# Altium schematic sheet VibrationACQ.SchDoc: VibrationACQ
size A4; Author: Joao Guimaraes; Organization: Altium Limited; Address1: L3, 12a Rodborough Rd; Address2: Frenchs Forest; Address3: NSW; Address4: Australia 2086; Revision: 1.0.0
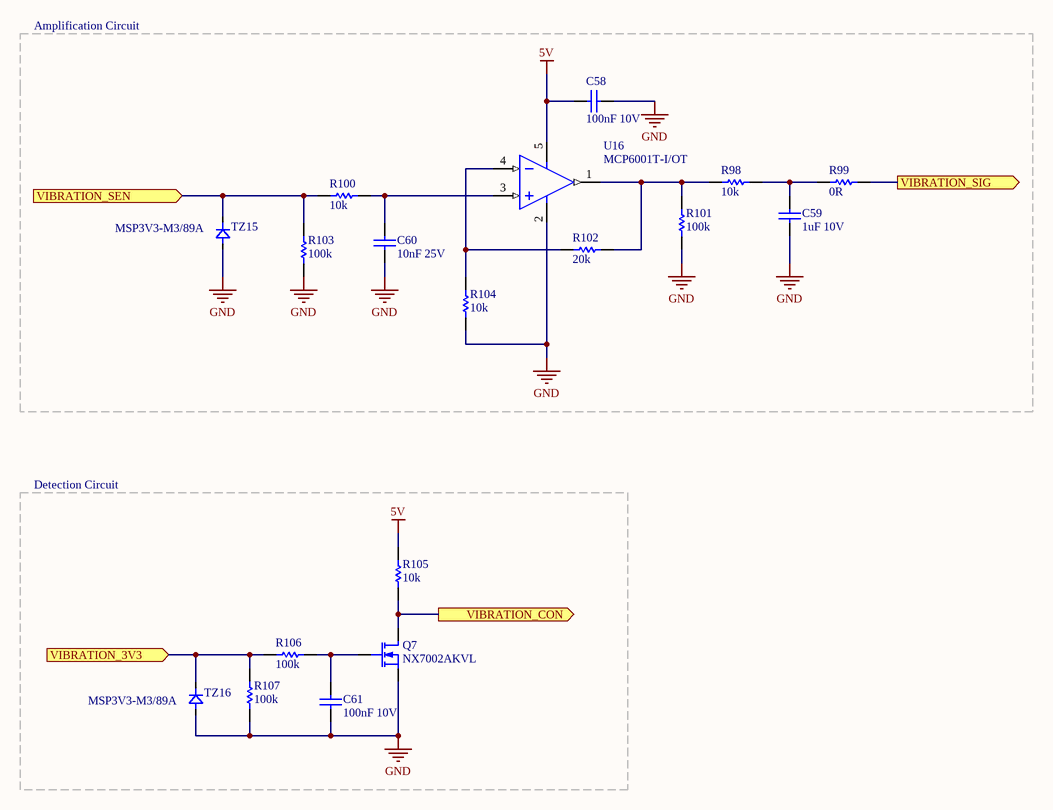
[diagram p0: VibrationACQ.SchDoc]

## Parts
C58  100nF 10V  [0402]
C59  1uF 10V  [C0805]
C60  10nF 25V  [1608[0603]]
C61  100nF 10V  [0402]
Q7  NX7002AKVL  [SOT23_M]
R98  10k  [6-0805_M]
R99  0R  [6-0805_M]
R100  10k  [6-0805_M]
R101  100k  [6-0805_M]
R102  20k  [6-0805_M]
R103  100k  [6-0805_M]
R104  10k  [6-0805_M]
R105  10k  [6-0805_M]
R106  100k  [6-0805_M]
R107  100k  [6-0805_M]
TZ15  MSP3V3-M3/89A  [DO-219AD]
TZ16  MSP3V3-M3/89A  [DO-219AD]
U16  MCP6001T-I/OT  [SOT23-5]

## Blocks framed on the sheet
Amplification Circuit: C58-C60 R98-R104 TZ15 U16
Detection Circuit: C61 Q7 R105-R107 TZ16

## Ports
VIBRATION_3V3 (in), VIBRATION_CON (out), VIBRATION_SEN (in), VIBRATION_SIG (out)

## Nets
5V: C58.1 R105.2 U16.5(V+)
GND: C58.2 C59.1 C60.1 C61.1 Q7.2(S) R101.1 R103.2 R104.1 R107.2 TZ15.1(A) TZ16.1(A) U16.2(V-)
VIBRATION_3V3: R106.2 R107.1 TZ16.2(C) ; port VIBRATION_3V3
VIBRATION_CON: Q7.3(D) R105.1 ; port VIBRATION_CON
VIBRATION_SEN: R100.1 R103.1 TZ15.2(C) ; port VIBRATION_SEN
VIBRATION_SIG: R99.1 ; port VIBRATION_SIG
NetC59_2: C59.2 R98.1 R99.2
NetC60_2: C60.2 R100.2 U16.3(IN+)
NetC61_2: C61.2 Q7.1(G) R106.1
NetR98_2: R98.2 R101.2 R102.2 U16.1(Out)
NetR102_1: R102.1 R104.2 U16.4(IN-)

## Notes on the sheet
- Title:
- Project:
- Date:
- Author:
- Version:
- File:

## Library data of the parts
C58 C61 = Cap: Capacitor; PartNumber: CAP.100n.10V.20%.SMD.0402; Manufacturer: Wurth; ClassName: VibrationACQ; Price: 0.015; Supplier: Mouser
C59 = Cap: Capacitor; PartNumber: CAP.1u.10V.10%.SMD.0805; Manufacturer: Vishay; ClassName: VibrationACQ; Price: 0.17; Supplier: Mouser
C60 = Cap: Capacitor; PartNumber: CAP.10n.25V.10%.SMD.0603; Manufacturer: Wurth; ClassName: VibrationACQ; Price: 0.10; Supplier: Mouser
Q7 = NX7002AKVL: Small Signal MOSFET 60 V, 310 mA, Single, N−Channel, SOT−23; Manufacturer: Nexperia; ClassName: VibrationACQ; PartNumber: NX7002AKVL; Price: 0.16; Supplier: Mouser
R98 R100 R104 R105 = Res: Resistor; PartNumber: RES.10K.1/8W.5%.SMD.0805; Manufacturer: Yageo; ClassName: VibrationACQ; Price: 0.012; Supplier: Mouser
R99 = Res: Resistor; PartNumber: RES.0R.1/8W.5%.SMD.0805; Manufacturer: Vishay; ClassName: VibrationACQ; Price: 0.044; Supplier: Mouser
R101 R106 = Res: Resistor; PartNumber: RES.100K.1/8W.5%.SMD.0805; Manufacturer: Yageo; ClassName: VibrationACQ; Price: 0.012; Supplier: Mouser
R102 = Res: Resistor; PartNumber: RES.20K.1/8W.1%.SMD.0805; Manufacturer: Vishay; ClassName: VibrationACQ; Price: 0.10; Supplier: Mouser
R103 R107 = Res: Resistor; PartNumber: RES.100k.1/8W.5%.SMD.0805; Manufacturer: Bourns; ClassName: VibrationACQ; Price: 0.012; Supplier: Mouser
TZ15 TZ16 = MSP3V3-M3/89A: ESD Suppressors / TVS Diodes 100W 3.3V Unidirect; pin to pad: 1>A 2>C; Manufacturer: Vishay; ClassName: VibrationACQ; PartNumber: MSP3V3-M3/89A; Price: 0.41; Supplier: Mouser
U16 = MCP6001T-I/OT: Operational Amplifiers - Op Amps Single 1.8V 1MHz; Manufacturer: Microchip; ClassName: VibrationACQ; PartNumber: MCP6001T-I/OT; Price: 0.29; Supplier: Mouser